# EAGLE design Ring (EAGLE 9.6.2)
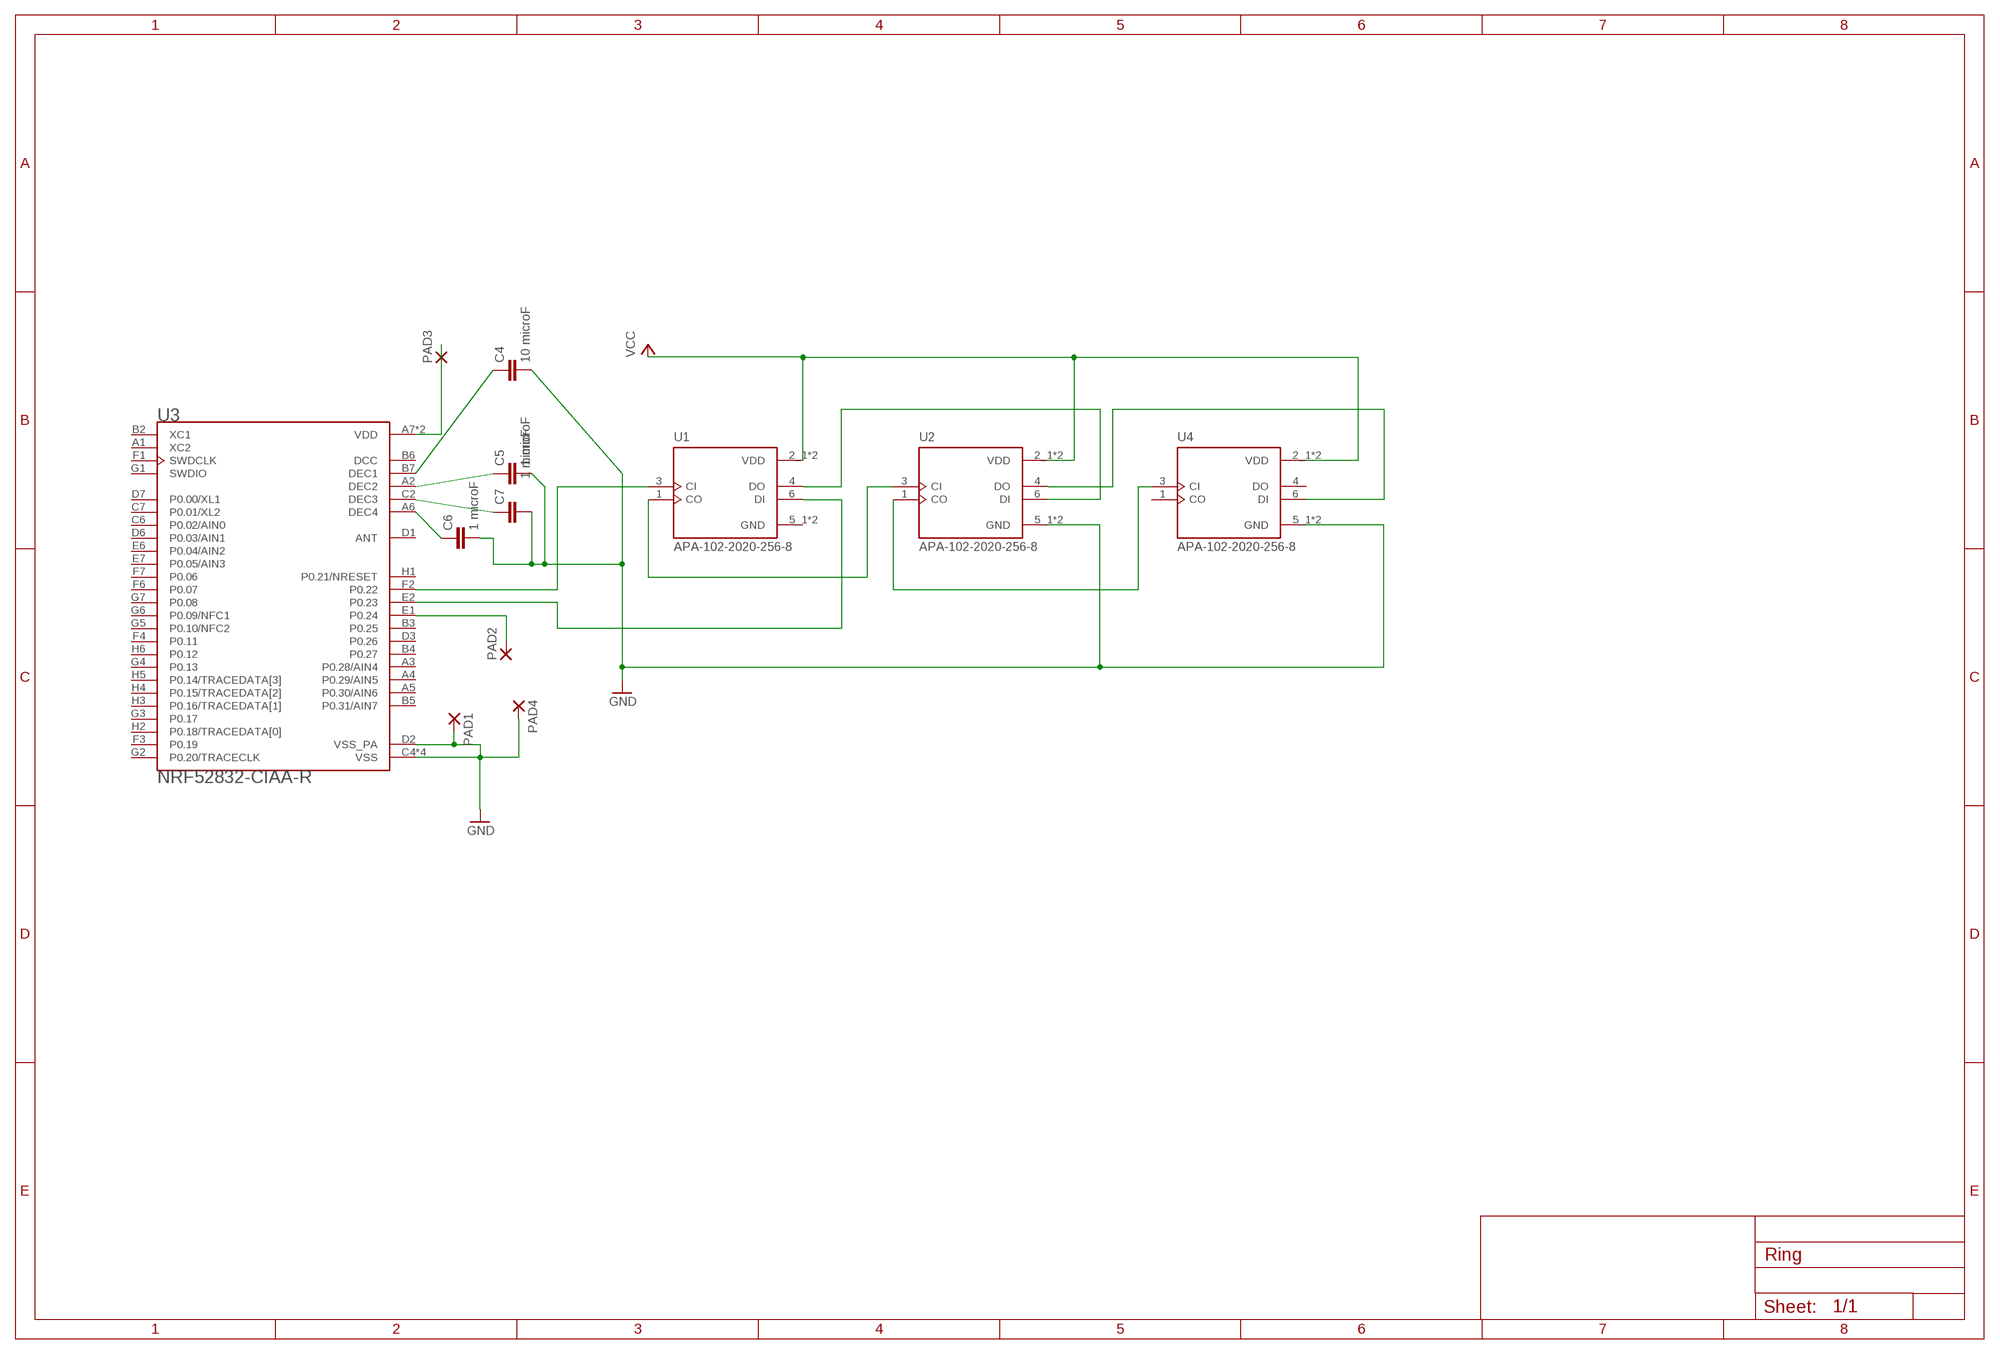
[diagram p0: schematic, sheet 1]

## Parts
C4  10 microF  C2,5-3  [C2.5-3]
C5  1 microF  C2,5-3  [C2.5-3]
C6  1 microF  C2,5-3  [C2.5-3]
C7  1 microF  C2,5-3  [C2.5-3]
PAD1  1,6/0,8  [1,6/0,8]
PAD2  1,6/0,8  [1,6/0,8]
PAD3  1,6/0,8  [1,6/0,8]
PAD4  1,6/0,8  [1,6/0,8]
U1  APA-102-2020-256-8  [LED_APA-102-2020-256-8]
U2  APA-102-2020-256-8  [LED_APA-102-2020-256-8]
U3  NRF52832-CIAA-R  [BGA50N40P7X8_300X320X40]
U4  APA-102-2020-256-8  [LED_APA-102-2020-256-8]

## Nets
GND: C4.2 C5.2 C6.2 C7.2 PAD1.1(P) PAD4.1(P) U2.5_1(GND) U2.5_2(GND) U3.C4(VSS) U3.C5(VSS) U3.D2(VSS_PA) U3.E3(VSS) U3.F5(VSS) U4.5_1(GND) U4.5_2(GND)
N$2: U1.1(CO) U2.3(CI)
N$4: U1.3(CI) U3.F2(P0.22)
N$5: U1.6(DI) U3.E2(P0.23)
N$6: U1.4(DO) U2.6(DI)
N$7: U2.1(CO) U4.3(CI)
N$8: U2.4(DO) U4.6(DI)
N$15: PAD2.1(P) U3.E1(P0.24)
N$18: PAD3.1(P) U3.A7(VDD) U3.H7(VDD)
N$20: C4.1 U3.B7(DEC1)
N$21: C5.1 U3.A2(DEC2)
N$22: C7.1 U3.C2(DEC3)
N$23: C6.1 U3.A6(DEC4)
VCC: U1.2_1(VDD) U1.2_2(VDD) U2.2_1(VDD) U2.2_2(VDD) U4.2_1(VDD) U4.2_2(VDD)
Unconnected: U3.A1(XC2) U3.A3(P0.28/AIN4) U3.A4(P0.29/AIN5) U3.A5(P0.30/AIN6) U3.B2(XC1) U3.B3(P0.25) U3.B4(P0.27) U3.B5(P0.31/AIN7) U3.C6(P0.02/AIN0) U3.C7(P0.01/XL2) U3.D1(ANT) U3.D3(P0.26) U3.D6(P0.03/AIN1) U3.D7(P0.00/XL1) U3.E6(P0.04/AIN2) U3.E7(P0.05/AIN3) U3.F1(SWDCLK) U3.F3(P0.19) U3.F4(P0.11) U3.F6(P0.07) U3.F7(P0.06) U3.G1(SWDIO) U3.G2(P0.20/TRACECLK) U3.G3(P0.17) U3.G4(P0.13) U3.G5(P0.10/NFC2) U3.G6(P0.09/NFC1) U3.G7(P0.08) U3.H1(P0.21/NRESET) U3.H2(P0.18/TRACEDATA[0]) U3.H3(P0.16/TRACEDATA[1]) U3.H4(P0.15/TRACEDATA[2]) U3.H5(P0.14/TRACEDATA[3]) U3.H6(P0.12) U4.1(CO) U4.4(DO)

## Power pins joined to a net without a drawn wire
DCC: U3.B6(DCC)
GND: U1.5_1(GND) U1.5_2(GND)

## Library data of the parts
C4-C7 = capacitor-wima:C: CAPACITOR naming: grid - package width
PAD1-PAD4 = wirepad:1,6/0,8: THROUGH-HOLE PAD
U1 U2 U4 = APA-102-2020-256-8:APA-102-2020-256-8: 8-pin type LED three-color RGB Dimming control Check availability <https://pricing.snapeda.com/parts/APA-102-2020-256-8/iPixel%20LED%20Light%20Co./view-part?ref=eda>; AVAILABILITY: Not in stock; DESCRIPTION: 8-pin type LED three-color RGB Dimming control; MF: iPixel LED Light Co.; MP: APA-102-2020-256-8; PACKAGE: SMD-8 iPixel LED Light Co.; PRICE: None
U3 = NRF52832-CIAA-R:NRF52832-CIAA-R: Multi Protocal Bluetooth Smart ANT 2.4GHz RF SoC (WL-CSP) Check availability <https://pricing.snapeda.com/parts/NRF52832-CIAA-R/Nordic/view-part?ref=eda>; AVAILABILITY: In Stock; DESCRIPTION: IC RF TxRx + MCU General ISM > 1GHz ANT, Bluetooth v5.0 2.4GHz 50-XFBGA, WLCSP; MF: Nordic; MP: NRF52832-CIAA-R; PACKAGE: XFBGA-50 Nordic Semiconductor; PRICE: None; PURCHASE-URL: https://pricing.snapeda.com/search/part/NRF52832-CIAA-R/?ref=eda

## Board
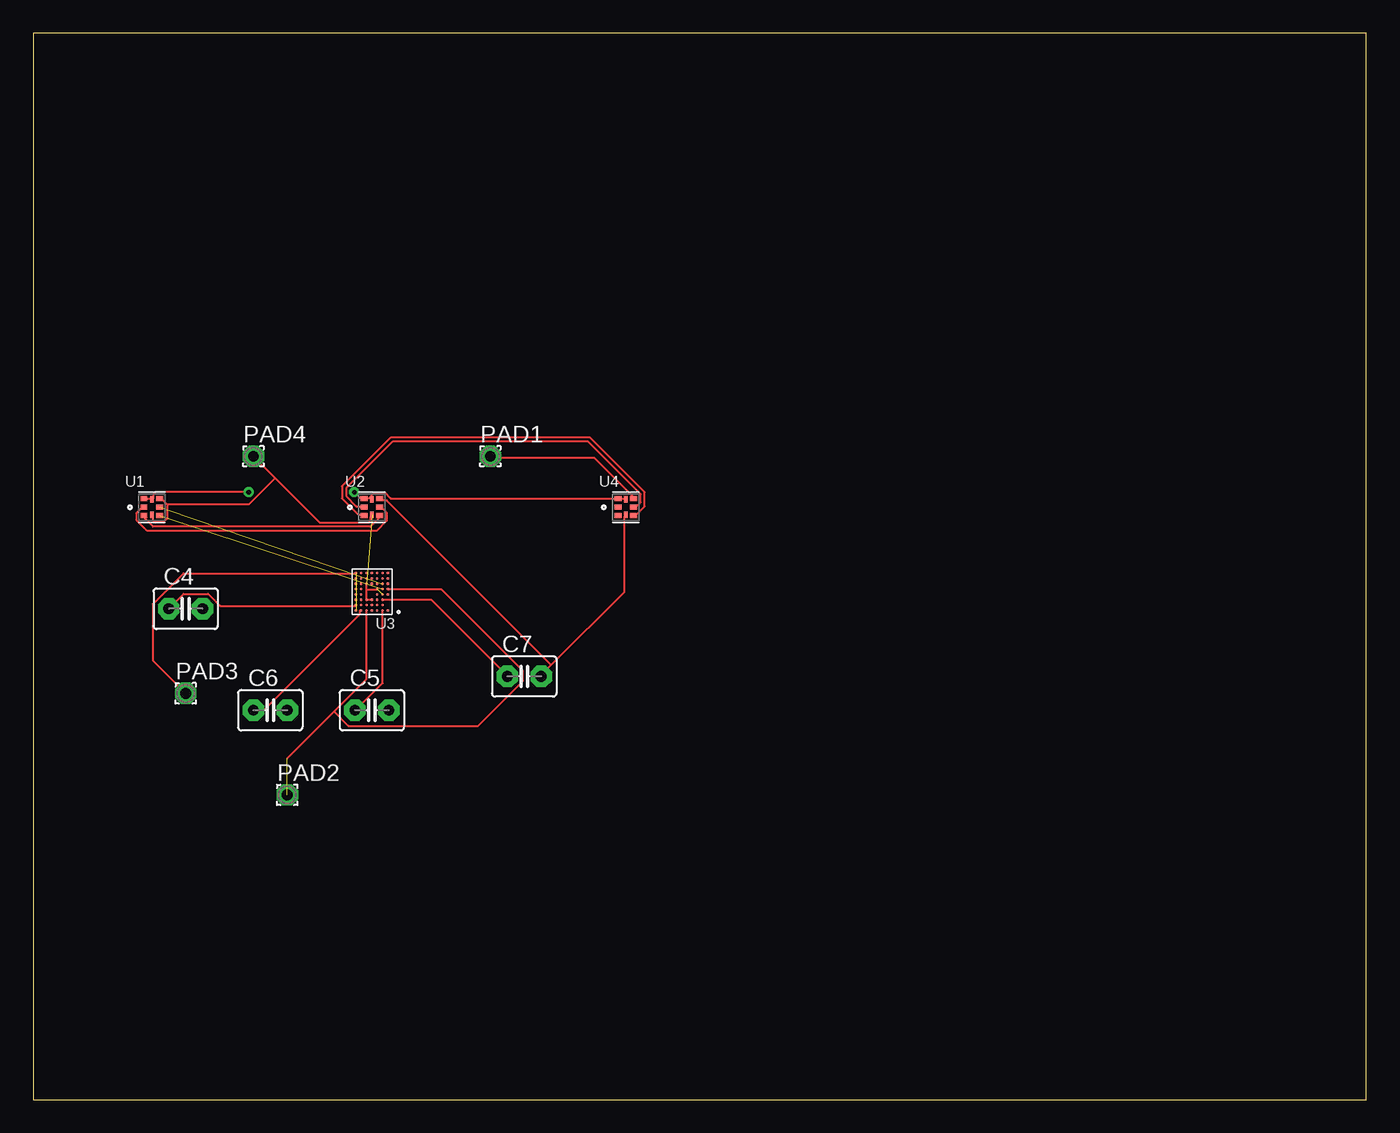
[diagram p1: board, top side]
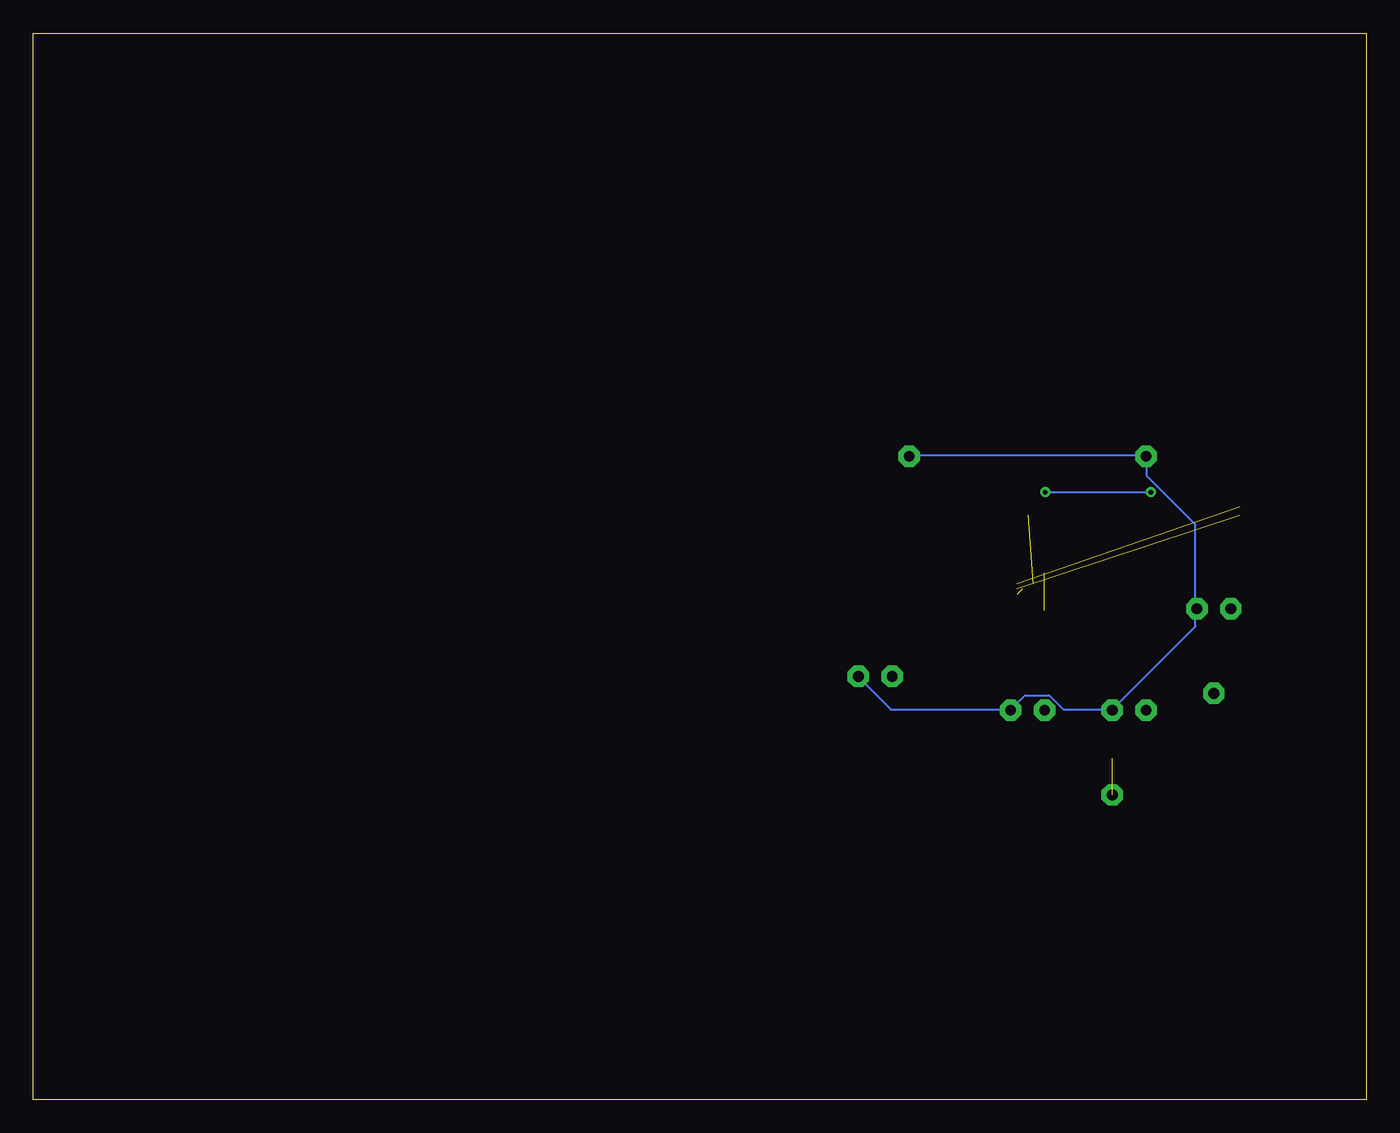
[diagram p2: board, bottom side, seen from below]

Size 100 x 80 mm. Coordinates in mm from the lower left corner, seen from the top.
Outline: 0,0 100,0 100,80 0,80 0,0
Copper layers (1*16): Top 0.035mm / dielectric 1.5mm / Bottom 0.035mm
Design rules "default": minimum track width 6mil, minimum drill 0.35mm, track to track 6mil, track to pad 6mil, pad to pad 6mil, via to via 6mil, smd to smd 6mil, copper to edge 40mil, drill to drill 6mil, minimum pad ring 10mil, minimum via ring 8mil, stop-mask expansion 4mil, vias tented up to drill 0mil, thermal gap 10mil

### Footprints (pad centres in the part's own frame; a part is rotated, then mirrored left to right if it is on the bottom)
C2.5-3 = drill 0.813 pad 1.6 octagon: 1 -1.27,0; 2 1.27,0
1,6/0,8 = drill 0.813 pad 1.6 octagon: 1 0,0
LED_APA-102-2020-256-8 = smd 0.5 x 0.37: 1 -0.585,0; 2_1 -0.585,0.64; 3 0.585,0; 4 -0.585,-0.64; 5_2 0.585,0.64; 6 0.585,-0.64 | smd 0.25 x 0.5: 2_2 0,0.575; 5_1 0,-0.575
BGA50N40P7X8_300X320X40 = smd 0.2 x 0.2: A1 -1.2,1.4; A2 -0.8,1.4; A3 -0.4,1.4; A4 0,1.4; A5 0.4,1.4; A6 0.8,1.4; A7 1.2,1.4; B2 -0.8,1; B3 -0.4,1; B4 0,1; B5 0.4,1; B6 0.8,1; B7 1.2,1; C2 -0.8,0.6; C3 -0.4,0.6; C4 0,0.6; C5 0.4,0.6; C6 0.8,0.6; C7 1.2,0.6; D1 -1.2,0.2; D2 -0.8,0.2; D3 -0.4,0.2; D6 0.8,0.2; D7 1.2,0.2; E1 -1.2,-0.2; E2 -0.8,-0.2; E3 -0.4,-0.2; E6 0.8,-0.2; E7 1.2,-0.2; F1 -1.2,-0.6; F2 -0.8,-0.6; F3 -0.4,-0.6; F4 0,-0.6; F5 0.4,-0.6; F6 0.8,-0.6; F7 1.2,-0.6; G1 -1.2,-1; G2 -0.8,-1; G3 -0.4,-1; G4 0,-1; G5 0.4,-1; G6 0.8,-1; G7 1.2,-1; H1 -1.2,-1.4; H2 -0.8,-1.4; H3 -0.4,-1.4; H4 0,-1.4; H5 0.4,-1.4; H6 0.8,-1.4; H7 1.2,-1.4

### Placement (x,y rotation side)
C4  11.43,36.83 0 top
C5  25.4,29.21 0 top
C6  17.78,29.21 0 top
C7  36.83,31.75 0 top
PAD1  34.29,48.26 0 top
PAD2  19.05,22.86 0 top
PAD3  11.43,30.48 0 top
PAD4  16.51,48.26 0 top
U1  8.89,44.45 0 top
U2  25.4,44.45 0 top
U3  25.4,38.1 180 top
U4  44.45,44.45 0 top

### Tracks (layer width: path | path; a pad name or v marks a point on that pad's centre or on a via)
GND  (2 unrouted)
  Top 0.152: U3.C5 25.45,37.49 U3.C4 | U3.C5 24.99,38.25 | 24.99,38.25 U3.F5 | U3.C5 | 24.99,38.25 25.76,38.25 U3.E3 | U4.5_2 44.96,45.11 44.96,45.26 42.06,48.16 34.29,48.16 PAD1.1 | 10.06,44.65 10.06,43.59 9.75,43.28 9.14,43.28 8.99,43.43 8.99,43.74 U1.5_1 | 10.06,44.65 9.6,45.11 U1.5_2 | PAD4.1 18.14,46.63 | 18.14,46.63 21.49,43.28 25.15,43.28 25.3,43.43 25.3,43.74 U2.5_1 | 10.06,44.65 16.15,44.65 18.14,46.63 | 38.86,32.61 38.1,31.85 C7.2 | 38.86,32.61 44.35,38.1 44.35,43.74 U4.5_1 | 38.86,32.61 26.52,44.96 26.06,44.96 U2.5_2
  Bottom 0.152: PAD1.1 34.29,48.31 16.61,48.31 PAD4.1 16.46,48.16 16.46,46.79 12.8,43.13 12.8,36.88 C4.2 12.8,36.73 12.8,35.51 19.05,29.26 | 19.05,29.26 22.71,29.26 23.77,30.33 25.6,30.33 26.67,29.26 | 19.05,29.26 C6.2 | 26.67,29.26 35.66,29.26 38.1,31.7 C7.2 | 26.67,29.26 C5.2
N$2
  Top 0.152: U1.1 8.23,44.35 8.08,44.35 7.77,44.04 7.77,43.43 8.53,42.67 25.76,42.67 26.52,43.43 26.52,44.04 26.06,44.5 U2.3
N$4  (1 unrouted)
N$5  (1 unrouted)
N$6
  Top 0.152: U1.4 8.38,43.74 8.38,43.59 8.99,42.98 25.3,42.98 26.06,43.74 U2.6
N$7
  Top 0.152: U2.1 24.69,44.5 24.23,44.5 23.47,45.26 23.47,45.87 26.98,49.38 41.6,49.38 45.57,45.41 45.57,44.81 45.11,44.35 U4.3
N$8
  Top 0.152: U2.4 24.69,43.89 24.38,43.89 23.16,45.11 23.16,46.02 26.82,49.68 41.76,49.68 45.87,45.57 45.87,44.5 45.11,43.74 U4.6
N$15  (1 unrouted)
  Top 0.152: 24.99,36.73 24.99,31.55 22.55,29.11 | 19.05,25.6 22.55,29.11 | 22.55,29.11 23.62,28.04 33.38,28.04 36.73,31.39 36.73,32.16 30.63,38.25 26.67,38.25 U3.E1
N$18  (1 unrouted)
  Top 0.152: PAD3.1 8.99,32.92 8.99,37.19 11.28,39.47 24.23,39.47 U3.H7
N$20
  Top 0.152: C4.1 11.28,37.95 13.11,37.95 14.02,37.03 24.23,37.03 U3.B7
N$21
  Top 0.152: U3.A2 26.21,36.73 26.21,31.24 24.23,29.26 C5.1
N$22
  Top 0.152: U3.C2 26.21,37.49 29.87,37.49 35.51,31.85 C7.1
N$23
  Top 0.152: U3.A6 24.54,36.73 24.54,36.42 17.37,29.26 16.61,29.26 C6.1
VCC  (via drill 0.35)
  Top 0.152: U4.2_2 44.35,45.11 43.89,45.11 U4.2_1 43.74,45.11 26.82,45.11 26.36,45.57 25.6,45.57 25.15,45.11 | U1.2_1 8.38,45.11 8.84,45.11 U1.2_2 8.99,45.11 8.99,45.41 9.14,45.57 v16.15,45.57 | 25.15,45.11 25.3,45.11 U2.2_2 | 25.15,45.11 24.84,45.11 U2.2_1 24.69,44.96 v24.08,45.57
  Bottom 0.152: v24.08,45.57 v16.15,45.57